# EAGLE design Placa de Baixo (EAGLE 9.3.0)

## Sheet 1 of 2
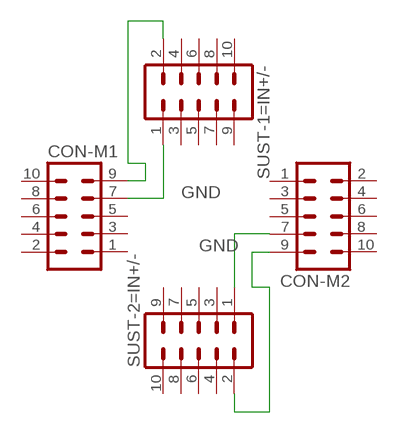
[diagram p0: schematic, sheet 1]

### Parts
CON-M1  ML10-3ML  [3M_10L]
CON-M2  ML10-3ML  [3M_10L]
SUST-1=IN+/-  MA05-2  [MA05-2]
SUST-2=IN+/-  MA05-2  [MA05-2]

### Nets
GND: CON-M1.7 CON-M2.7 SUST-1=IN+/-.1 SUST-2=IN+/-.1
N$1: CON-M1.9 SUST-1=IN+/-.2
N$3: CON-M2.9 SUST-2=IN+/-.2
Unconnected: CON-M1.1 CON-M1.2 CON-M1.3 CON-M1.4 CON-M1.5 CON-M1.6 CON-M1.8 CON-M1.10 CON-M2.1 CON-M2.2 CON-M2.3 CON-M2.4 CON-M2.5 CON-M2.6 CON-M2.8 CON-M2.10 SUST-1=IN+/-.3 SUST-1=IN+/-.4 SUST-1=IN+/-.5 SUST-1=IN+/-.6 SUST-1=IN+/-.7 SUST-1=IN+/-.8 SUST-1=IN+/-.9 SUST-1=IN+/-.10 SUST-2=IN+/-.3 SUST-2=IN+/-.4 SUST-2=IN+/-.5 SUST-2=IN+/-.6 SUST-2=IN+/-.7 SUST-2=IN+/-.8 SUST-2=IN+/-.9 SUST-2=IN+/-.10

## Sheet 2 of 2

## Library data of the parts
CON-M1 CON-M2 = con-harting-ml:ML10: HARTING; OC_FARNELL: unknown; OC_NEWARK: unknown
SUST-1=IN+/- SUST-2=IN+/- = con-lstb:MA05-2: PIN HEADER; OC_FARNELL: unknown; OC_NEWARK: unknown

## Board
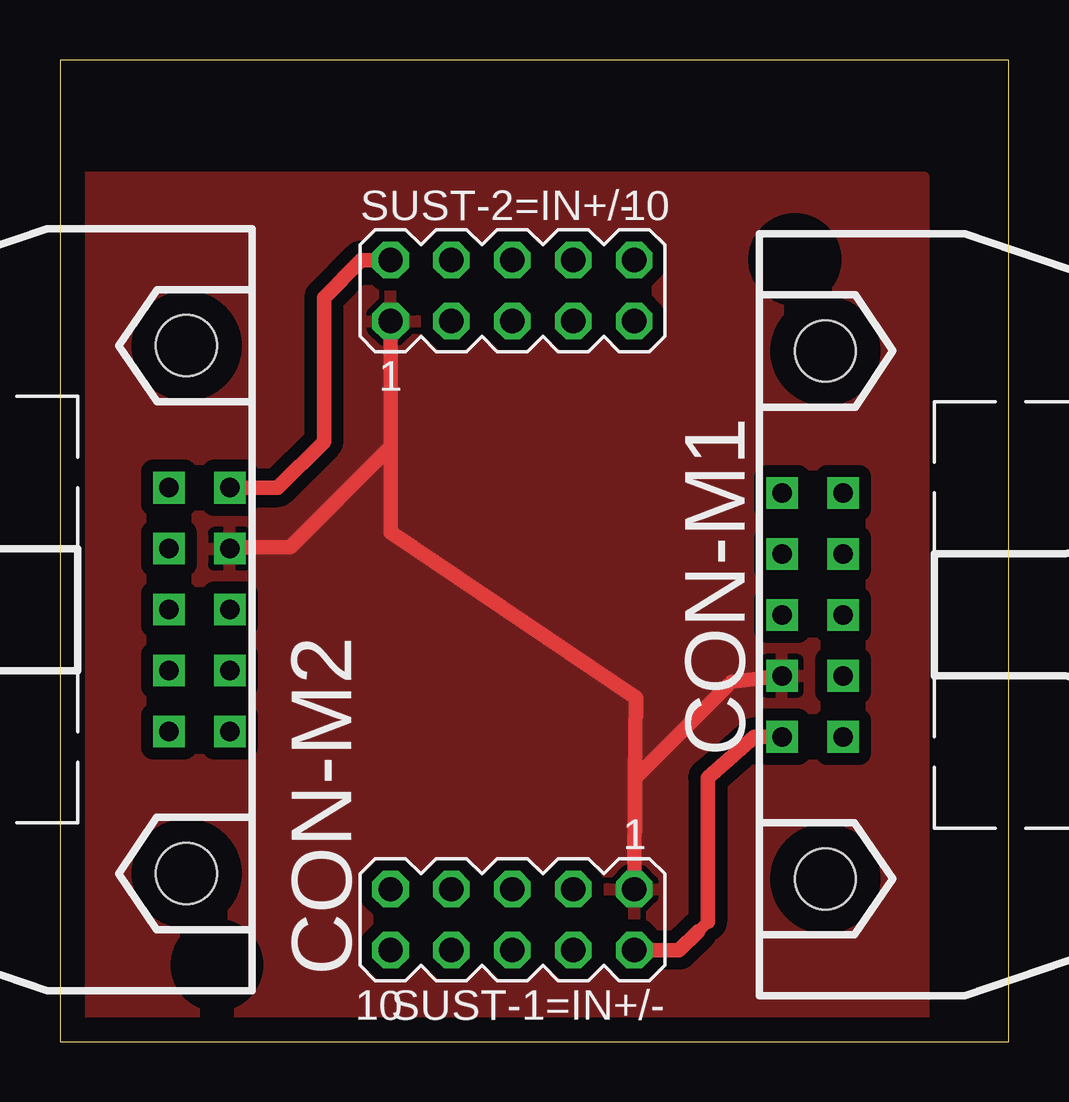
[diagram p1: board, top side]

Size 39.55 x 40.9 mm. Coordinates in mm from the lower left corner, seen from the top.
Outline: 0,0 39.55,0 39.55,40.9 0,40.9 0,0
Copper layers (1*16): Top 0.035mm / dielectric 1.5mm / Bottom 0.035mm
Design rules "default *": minimum track width 10mil, minimum drill 24mil, track to track 20mil, track to pad 20mil, pad to pad 8mil, via to via 8mil, smd to smd 8mil, copper to edge 40mil, drill to drill 8mil, minimum pad ring 10mil, minimum via ring 8mil, stop-mask expansion 4mil, vias tented up to drill 0mil, thermal gap 10mil

### Footprints (pad centres in the part's own frame; a part is rotated, then mirrored left to right if it is on the bottom)
3M_10L = drill 0.813 square: 1 -5.08,-5.08; 2 -5.08,-2.54; 3 -2.54,-5.08; 4 -2.54,-2.54; 5 0,-5.08; 6 0,-2.54; 7 2.54,-5.08; 8 2.54,-2.54; 9 5.08,-5.08; 10 5.08,-2.54 | hole 2.54: -10.998,-3.277; 10.998,-3.277
MA05-2 = drill 1.016 octagon: 1 -5.08,-1.27; 2 -5.08,1.27; 3 -2.54,-1.27; 4 -2.54,1.27; 5 0,-1.27; 6 0,1.27; 7 2.54,-1.27; 8 2.54,1.27; 9 5.08,-1.27; 10 5.08,1.27

### Placement (x,y rotation side)
CON-M1  35.18,17.78 270 top
CON-M2  2,18 90 top
SUST-1=IN+/-  18.86,5.08 180 top
SUST-2=IN+/-  18.86,31.29 0 top

### Tracks (layer width: path | path; a pad name or v marks a point on that pad's centre or on a via)
GND
  Top 0.5: 28,15 27.82,14.82
  Top 0.61: CON-M2.7 7.13,20.59 9.59,20.59 13.78,24.78 | 13.78,24.78 SUST-2=IN+/-.1 | 13.78,24.78 13.78,21.22 24.02,14.32 23.98,10.98 | CON-M1.7 28,15 | 27.82,14.82 23.98,10.98 | 23.98,10.98 SUST-1=IN+/-.1
  pour Top: 1,1 36,1 36,36 1,36
N$1
  Top 0.5: 27,5 26.61,4.61
  Top 0.61: CON-M1.9 28.94,12.7 27,11 27,5 | 26.61,4.61 25.81,3.81 SUST-1=IN+/-.2
N$3
  Top 0.61: CON-M2.9 9.08,23.08 11,25 11,31 12.56,32.56 SUST-2=IN+/-.2